# EAGLE design met (EAGLE 7.6.0)
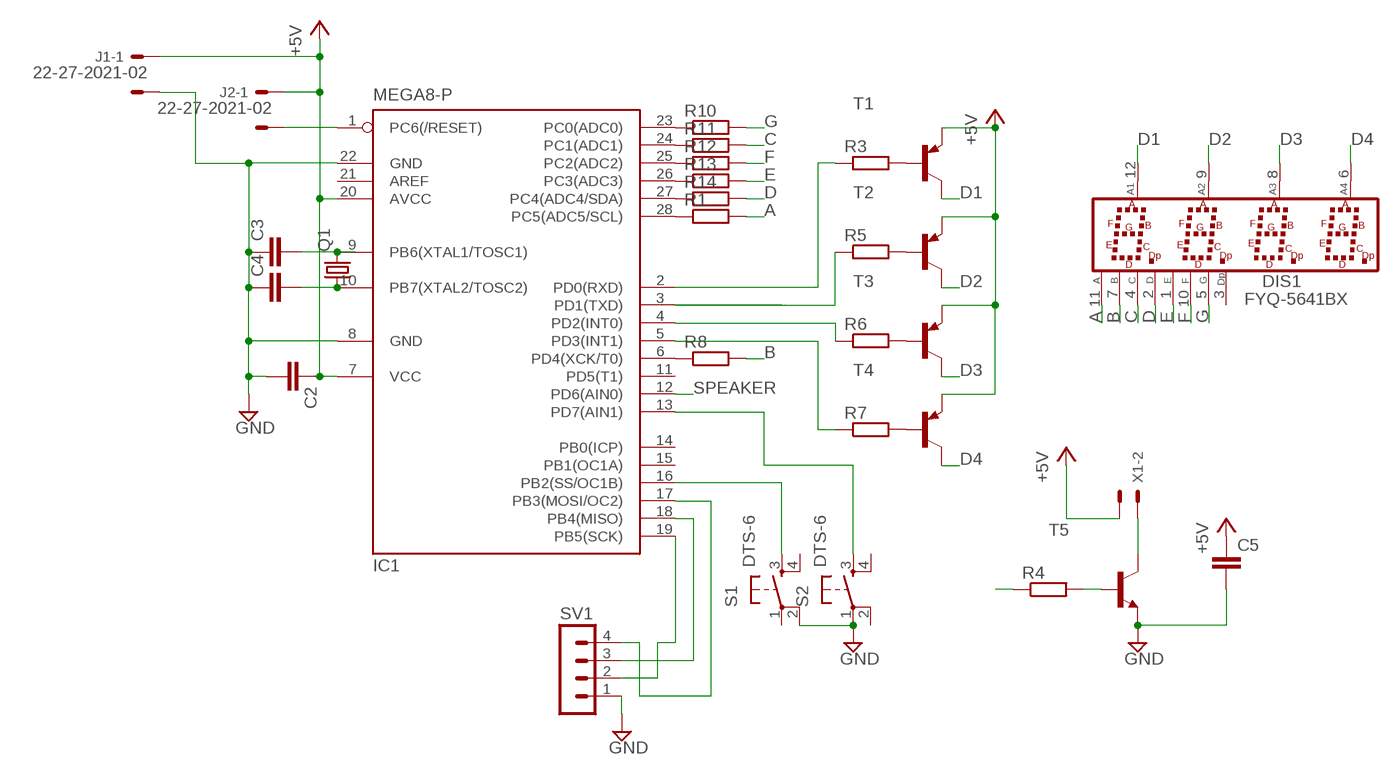
[diagram p0: schematic, sheet 1]

## Parts
C2  C-EU025-024X044  [C025-024X044]
C3  C-EU025-024X044  [C025-024X044]
C4  C-EU025-024X044  [C025-024X044]
C5  C-EU075-032X103  [C075-032X103]
DIS1  FYQ-5641BX  [FYQ5641]
IC1  MEGA8-P  [DIL28-3]
J1  22-27-2021-02  [6410-02]
J2  22-27-2021-02  [6410-02]
Q1  CRYSTALS-NOGND-HC49  [HC49]
R1  R-EU_0204/5  [0204/5]
R3  R-EU_0207/10  [0207/10]
R4  R-EU_0309/12  [0309/12]
R5  R-EU_0207/10  [0207/10]
R6  R-EU_0207/10  [0207/10]
R7  R-EU_0207/10  [0207/10]
R8  R-EU_0204/5  [0204/5]
R10  R-EU_0204/5  [0204/5]
R11  R-EU_0204/5  [0204/5]
R12  R-EU_0204/5  [0204/5]
R13  R-EU_0204/5  [0204/5]
R14  R-EU_0204/5  [0204/5]
S1  DTS-6  [DTS-6]
S2  DTS-6  [DTS-6]
SV1  MA04-1  [MA04-1]
T1  BC327-PNP-TO92-EBC  [TO92-EBC]
T2  BC327-PNP-TO92-EBC  [TO92-EBC]
T3  BC327-PNP-TO92-EBC  [TO92-EBC]
T4  BC327-PNP-TO92-EBC  [TO92-EBC]
T5  BC337-40-NPN-TO92-CBE  [TO92-CBE]
X1  22-23-2021  [22-23-2021]

## Nets
+5V: C2.1 C5.1 IC1.7(VCC) IC1.20(AVCC) J1.1 T1.E T2.E T3.E T4.E X1.1
A: DIS1.11(A) R1.2
B: DIS1.7(B) R8.2
C: DIS1.4(C) R11.2
D: DIS1.2(D) R14.2
D1: DIS1.12(A1) T1.C
D2: DIS1.9(A2) T2.C
D3: DIS1.8(A3) T3.C
D4: DIS1.6(A4) T4.C
E: DIS1.1(E) R13.2
F: DIS1.10(F) R12.2
G: DIS1.5(G) R10.2
GND: C2.2 C3.1 C4.1 C5.2 IC1.8(GND) IC1.22(GND) J1.2 S1.2 S2.1 SV1.1 T5.E
N$1: C3.2 IC1.9(PB6(XTAL1/TOSC1)) Q1.2
N$2: C4.2 IC1.10(PB7(XTAL2/TOSC2)) Q1.1
N$3: R3.2 T1.B
N$4: IC1.1(PC6(/RESET)) J2.2
N$5: R5.2 T2.B
N$6: R6.2 T3.B
N$7: R7.2 T4.B
N$8: IC1.2(PD0(RXD)) R3.1
N$9: IC1.3(PD1(TXD)) R5.1
N$10: IC1.4(PD2(INT0)) R6.1
N$11: IC1.5(PD3(INT1)) R7.1
N$12: IC1.16(PB2(SS/OC1B)) S1.3
N$13: IC1.13(PD7(AIN1)) S2.3
N$14: IC1.6(PD4(XCK/T0)) R8.1
N$15: J2.1
N$16: IC1.23(PC0(ADC0)) R10.1
N$17: IC1.24(PC1(ADC1)) R11.1
N$18: IC1.25(PC2(ADC2)) R12.1
N$19: IC1.26(PC3(ADC3)) R13.1
N$20: IC1.27(PC4(ADC4/SDA)) R14.1
N$21: IC1.28(PC5(ADC5/SCL)) R1.1
N$22: T5.C X1.2
N$23: IC1.19(PB5(SCK)) SV1.2
N$24: IC1.18(PB4(MISO)) SV1.3
N$25: IC1.17(PB3(MOSI/OC2)) SV1.4
OFDS: R4.2 T5.B
SPEAKER: IC1.12(PD6(AIN0)) R4.1
Unconnected: DIS1.3(DP) IC1.11(PD5(T1)) IC1.14(PB0(ICP)) IC1.15(PB1(OC1A)) IC1.21(AREF) S1.1 S1.4 S2.2 S2.4

## Library data of the parts
C2-C5 = rcl:C-EU: CAPACITOR, European symbol
DIS1 = LED 7seg:FYQ-5641BX
IC1 = atmel:MEGA8-P: MICROCONTROLLER 8 Kbytes FLASH, 1 kbytes SRAM, 512 bytes EEPROM, USART, 4-channel 10 bit ADC, 2-channel 8 bit ADC Pin compatible with Atmega48, ATMega88, ATMega168 Source: avr.lbr; OC_FARNELL: unknown; OC_NEWARK: unknown
J1 J2 = con-molex:22-?-02: CONNECTOR wire to board 2.54 mm (.1 inch) pitch header; OC_FARNELL: unknown; OC_NEWARK: unknown
Q1 = IQD-Frequency-Products:CRYSTALS-NOGND: CRYSTALS CAN NOT GROUNDED
R1 R3-R8 R10-R14 = rcl:R-EU_: RESISTOR, European symbol
S1 S2 = switch-tact:DTS-6
SV1 = con-lstb:MA04-1: PIN HEADER; OC_FARNELL: unknown; OC_NEWARK: unknown
T1-T4 = transistor:*-PNP-: PNP Transistror
T5 = transistor:*-NPN-: NPN Transistror BF959 corrected 2008.03.06
X1 = con-molex:22-23-2021: .100" (2.54mm) Center Header - 2 Pin; MF: MOLEX; MPN: 22-23-2021; OC_FARNELL: 1462926; OC_NEWARK: 25C3832

## Board
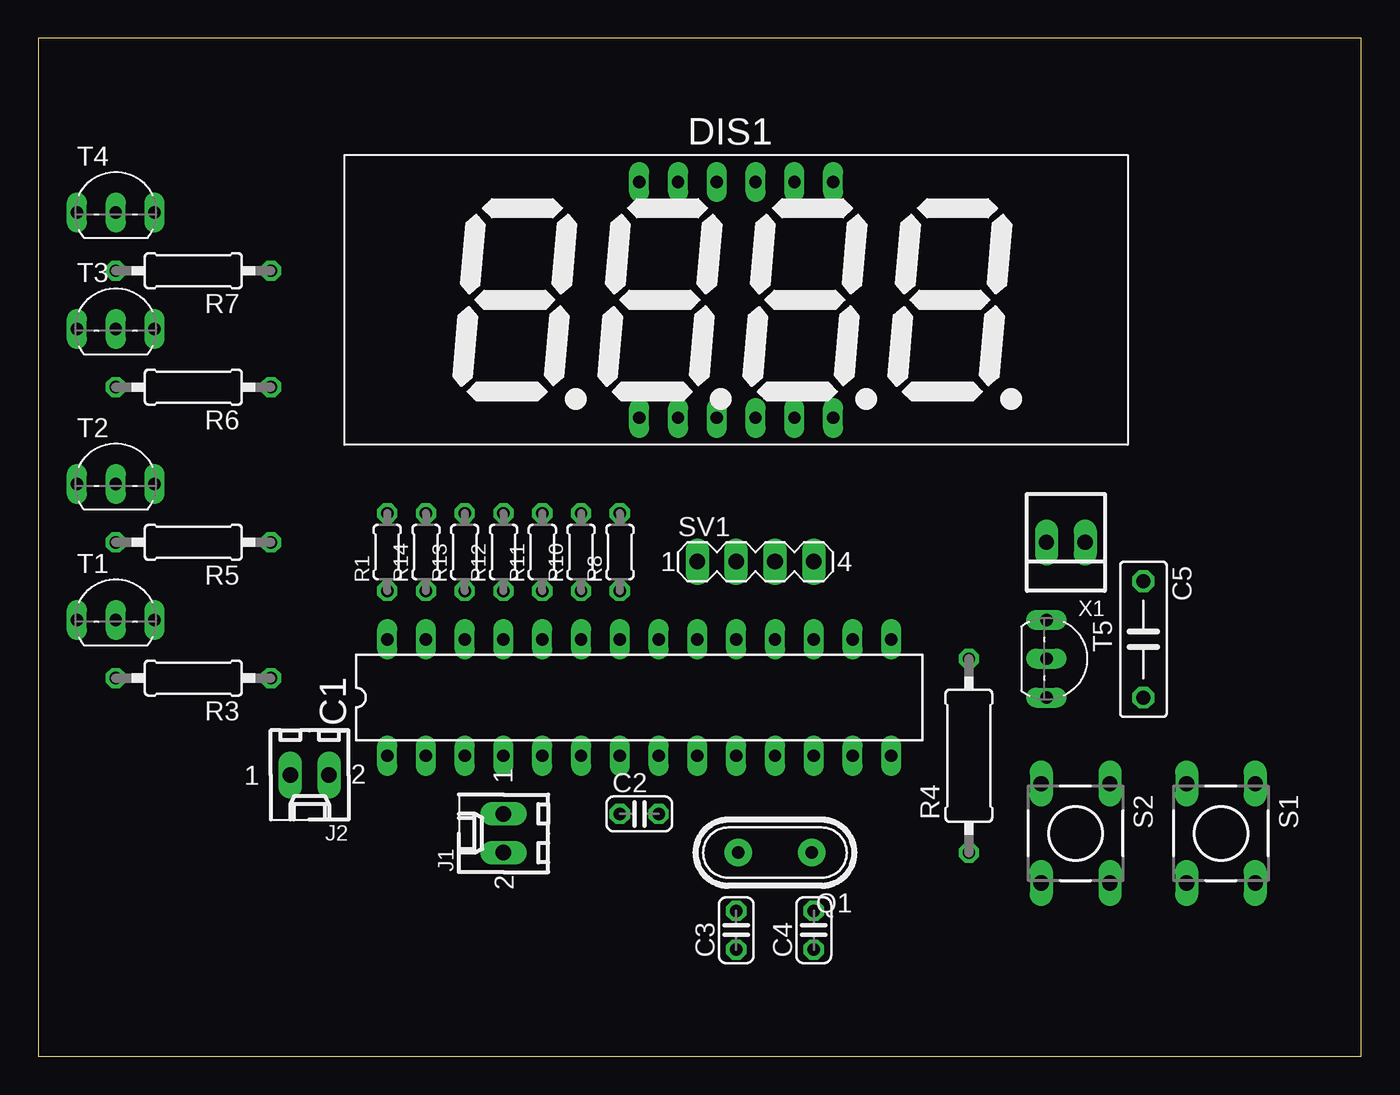
[diagram p1: board, top side]
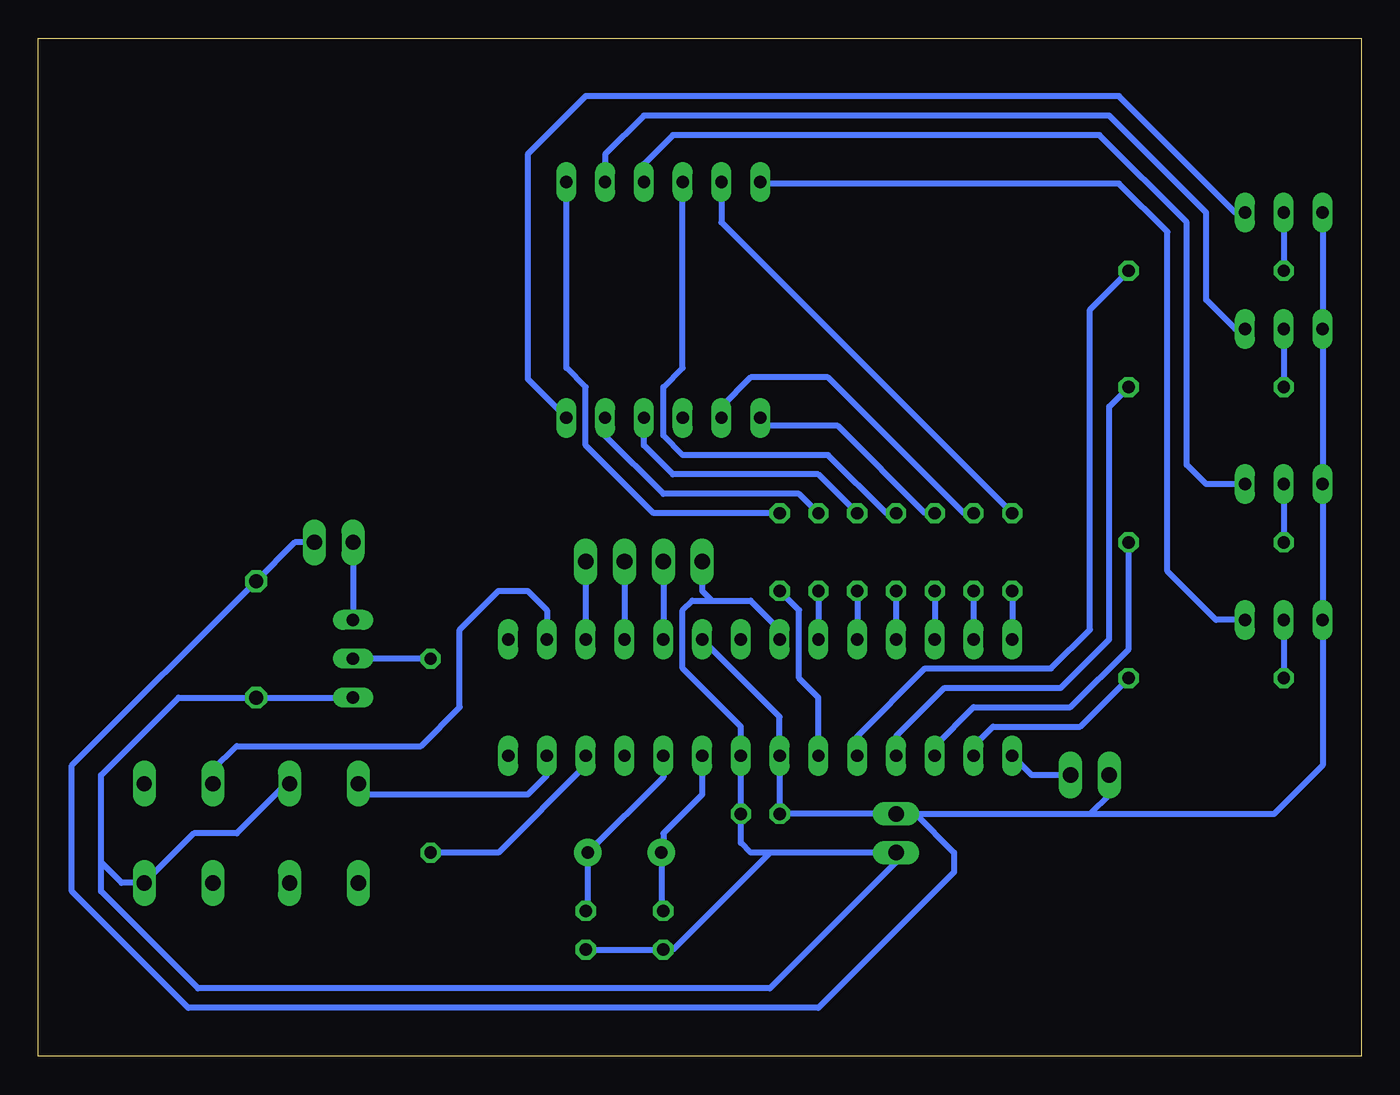
[diagram p2: board, bottom side, seen from below]

Size 86.67 x 66.67 mm. Coordinates in mm from the lower left corner, seen from the top.
Outline: 0,0 86.67,0 86.67,66.67 0,66.67 0,0
Copper layers (1*16): Top 0.035mm / dielectric 1.5mm / Bottom 0.035mm
Design rules "default": minimum track width 10mil, minimum drill 24mil, track to track 8mil, track to pad 8mil, pad to pad 8mil, via to via 8mil, smd to smd 8mil, copper to edge 40mil, drill to drill 8mil, minimum pad ring 10mil, minimum via ring 8mil, stop-mask expansion 4mil, vias tented up to drill 0mil, thermal gap 10mil

### Footprints (pad centres in the part's own frame; a part is rotated, then mirrored left to right if it is on the bottom)
C025-024X044 = drill 0.813 octagon: 1 -1.27,0; 2 1.27,0
C075-032X103 = drill 0.914 octagon: 1 -3.81,0; 2 3.81,0
FYQ5641 = drill 0.8 long: 1 -6.35,-7.72; 2 -3.81,-7.72; 3 -1.27,-7.72; 4 1.27,-7.72; 5 3.81,-7.72; 6 6.35,-7.72; 7 6.35,7.72; 8 3.81,7.72; 9 1.27,7.72; 10 -1.27,7.72; 11 -3.81,7.72; 12 -6.35,7.72
DIL28-3 = drill 0.813 long: 1 -16.51,-3.81; 2 -13.97,-3.81; 3 -11.43,-3.81; 4 -8.89,-3.81; 5 -6.35,-3.81; 6 -3.81,-3.81; 7 -1.27,-3.81; 8 1.27,-3.81; 9 3.81,-3.81; 10 6.35,-3.81; 11 8.89,-3.81; 12 11.43,-3.81; 13 13.97,-3.81; 14 16.51,-3.81; 15 16.51,3.81; 16 13.97,3.81; 17 11.43,3.81; 18 8.89,3.81; 19 6.35,3.81; 20 3.81,3.81; 21 1.27,3.81; 22 -1.27,3.81; 23 -3.81,3.81; 24 -6.35,3.81; 25 -8.89,3.81; 26 -11.43,3.81; 27 -13.97,3.81; 28 -16.51,3.81
6410-02 = drill 1.016 long: 1 1.27,0; 2 -1.27,0
HC49 = drill 0.813 pad 1.8: 1 -2.413,0; 2 2.413,0
0204/5 = drill 0.813 octagon: 1 -2.54,0; 2 2.54,0
0207/10 = drill 0.813 octagon: 1 -5.08,0; 2 5.08,0
0309/12 = drill 0.813 octagon: 1 -6.35,0; 2 6.35,0
DTS-6 = drill 1 long: 1 -3.25,2.25; 2 3.25,2.25; 3 -3.25,-2.25; 4 3.25,-2.25
MA04-1 = drill 1.016 long: 1 -3.81,0; 2 -1.27,0; 3 1.27,0; 4 3.81,0
TO92-EBC = drill 0.813 long: B 0,-1.27; C 2.54,-1.27; E -2.54,-1.27
TO92-CBE = drill 0.813 long: B 0,0; C -2.54,0; E 2.54,0
22-23-2021 = drill 1 long: 1 -1.27,0; 2 1.27,0

### Placement (x,y rotation side)
C2  39.37,15.88 0 top
C3  45.72,8.26 90 top
C4  50.8,8.26 90 top
C5  72.39,27.3 270 top
DIS1  45.72,49.53 0 top
IC1  39.37,23.5 0 top
J1  30.48,14.61 90 top
J2  17.78,18.41 180 top
Q1  48.26,13.34 180 top
R1  22.86,33.02 90 top
R3  10.16,24.77 180 top
R4  60.96,19.68 90 top
R5  10.16,33.66 180 top
R6  10.16,43.81 180 top
R7  10.16,51.44 180 top
R8  38.1,33.02 90 top
R10  35.56,33.02 90 top
R11  33.02,33.02 90 top
R12  30.48,33.02 90 top
R13  27.94,33.02 90 top
R14  25.4,33.02 90 top
S1  77.47,14.61 270 top
S2  67.94,14.61 270 top
SV1  46.99,32.38 0 top
T1  5.08,29.84 0 top
T2  5.08,38.73 0 top
T3  5.08,48.9 0 top
T4  5.08,56.52 0 top
T5  66.04,26.04 270 top
X1  67.31,33.66 180 top

### Tracks (layer width: path | path; a pad name or v marks a point on that pad's centre or on a via)
+5V
  Bottom 0.406: J1.1 C2.1 IC1.7 38.1,22.23 IC1.20 | J1.1 17.78,15.88 | 17.78,15.88 5.71,15.88 2.54,19.05 T1.E T2.E T3.E T4.E | J1.1 29.21,15.88 26.67,13.34 26.67,12.06 35.56,3.17 76.83,3.17 84.45,10.79 84.45,19.05 C5.1 69.85,33.66 X1.1 | 16.51,17.14 17.78,15.88
A
  Bottom 0.406: DIS1.11 41.91,54.61 R1.2
B
  Bottom 0.406: R8.2 46.35,35.56 50.8,40.01 50.8,43.81 52.07,45.09 DIS1.7
C
  Bottom 0.406: R11.2 35.56,38.1 45.09,38.1 46.99,40.01 DIS1.4
D
  Bottom 0.406: R14.2 26.04,35.56 34.92,44.45 40.01,44.45 41.91,42.55 DIS1.2
D1
  Bottom 0.406: T1.C 9.53,28.57 12.7,31.75 12.7,53.98 15.88,57.15 39.27,57.15 DIS1.12
D2
  Bottom 0.406: T2.C 10.16,37.47 11.43,38.73 11.43,54.61 17.14,60.33 45.09,60.33 46.99,58.42 DIS1.9
D3
  Bottom 0.406: T3.C 8.26,47.62 10.16,49.53 10.16,55.24 16.51,61.59 46.99,61.59 49.53,59.05 DIS1.8
D4
  Bottom 0.406: T4.C 8.26,55.24 15.88,62.87 50.8,62.87 54.61,59.05 54.61,44.35 DIS1.6
E
  Bottom 0.406: R13.2 28.57,35.56 34.29,41.27 38.84,41.27 DIS1.1
F
  Bottom 0.406: R12.2 31.11,35.56 34.92,39.37 44.45,39.37 45.72,40.64 45.72,43.81 44.45,45.09 DIS1.10
G
  Bottom 0.406: R10.2 36.83,36.83 45.72,36.83 49.53,40.64 DIS1.5
GND
  Bottom 0.406: 42.55,29.84 43.81,29.84 44.45,29.21 44.45,25.4 40.64,21.59 IC1.8 C2.2 40.64,13.97 40.01,13.34 38.73,13.34 | 42.55,29.84 40.01,29.84 38.1,27.94 IC1.22 | S2.1 70.41,17.86 73.66,14.61 76.47,14.61 S1.2 81.2,11.36 82.55,12.7 | 38.73,13.34 J1.2 30.48,12.7 38.73,4.45 76.2,4.45 82.55,10.79 82.55,12.7 | 82.55,12.7 82.55,18.41 77.47,23.5 C5.2 T5.E | C4.1 C3.1 45.09,6.99 38.73,13.34 | SV1.1 43.18,30.48 42.55,29.84
N$1
  Bottom 0.406: IC1.9 43.18,17.14 45.72,14.61 45.72,13.46 Q1.2 45.85,9.65 C3.2
N$2
  Bottom 0.406: IC1.10 45.72,18.29 Q1.1 50.67,9.65 C4.2
N$3
  Bottom 0.406: T1.B R3.2
N$4
  Bottom 0.406: J2.2 21.59,18.41 IC1.1
N$5
  Bottom 0.406: T2.B R5.2
N$6
  Bottom 0.406: T3.B R6.2
N$7
  Bottom 0.406: T4.B R7.2
N$8
  Bottom 0.406: IC1.2 25.4,20.32 24.13,21.59 18.41,21.59 R3.1
N$9
  Bottom 0.406: IC1.3 27.94,20.32 25.4,22.86 19.05,22.86 15.24,26.67 R5.1
N$10
  Bottom 0.406: IC1.4 30.48,20.95 27.3,24.13 19.68,24.13 16.51,27.3 16.51,42.55 R6.1
N$11
  Bottom 0.406: IC1.5 33.02,20.95 28.57,25.4 20.32,25.4 17.78,27.94 17.78,48.9 R7.1
N$12
  Bottom 0.406: S1.3 75.22,18.76 73.66,20.32 61.59,20.32 59.05,22.86 59.05,27.94 56.52,30.48 54.61,30.48 53.34,29.21 IC1.16
N$13
  Bottom 0.406: IC1.13 53.34,18.41 54.61,17.14 64.98,17.14 S2.3
N$14
  Bottom 0.406: IC1.6 35.56,23.5 36.83,24.77 36.83,29.21 R8.1
N$16
  Bottom 0.406: R10.1 IC1.23
N$17
  Bottom 0.406: R11.1 IC1.24
N$18
  Bottom 0.406: R12.1 IC1.25
N$19
  Bottom 0.406: R13.1 IC1.26
N$20
  Bottom 0.406: R14.1 IC1.27
N$21
  Bottom 0.406: R1.1 IC1.28
N$22
  Bottom 0.406: X1.2 T5.C
N$23
  Bottom 0.406: SV1.2 IC1.19
N$24
  Bottom 0.406: SV1.3 IC1.18
N$25
  Bottom 0.406: SV1.4 IC1.17
OFDS
  Bottom 0.406: R4.2 T5.B
SPEAKER
  Bottom 0.406: IC1.12 50.8,19.05 56.52,13.34 R4.1